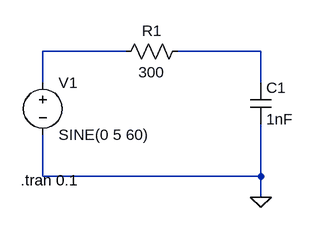
[diagram p0: schematic Draft1.asc]
Draft1.asc, the LTspice schematic file:
Version 4
SHEET 1 880 680
WIRE 192 112 64 112
WIRE 400 112 272 112
WIRE 64 160 64 112
WIRE 400 160 400 112
WIRE 64 304 64 240
WIRE 400 304 400 224
WIRE 400 304 64 304
WIRE 400 336 400 304
FLAG 400 336 0
SYMBOL res 288 96 R90
WINDOW 0 0 56 VBottom 2
WINDOW 3 32 56 VTop 2
SYMATTR InstName R1
SYMATTR Value 300
SYMBOL voltage 64 144 R0
WINDOW 123 0 0 Left 0
WINDOW 39 0 0 Left 0
SYMATTR InstName V1
SYMATTR Value SINE(0 5 60)
SYMBOL cap 384 160 R0
SYMATTR InstName C1
SYMATTR Value 1nF
TEXT 30 310 Left 2 !.tran 0.1

The netlist it stands for:
* Draft1.asc
R1 N002 N001 300
V1 N001 0 SINE(0 5 60)
C1 N002 0 1nF
.tran 0.1
.backanno
.end